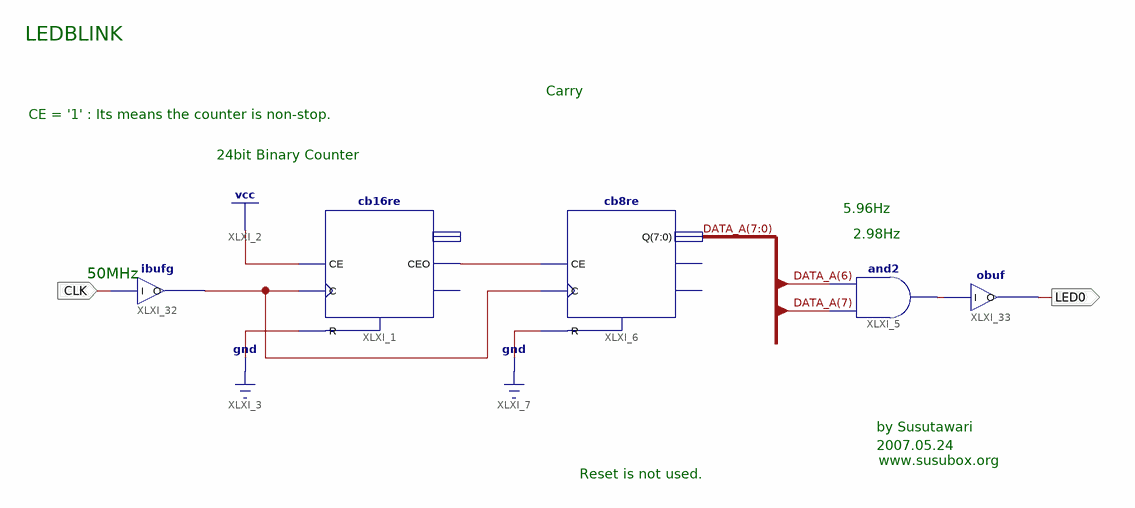
[diagram p0: schematic sheet 1]
// Xilinx ISE schematic LEDBLINK.sch (spartan6) as structural Verilog: 5 symbols, 2 ports
module LEDBLINK (
  input  CLK,
  output LED0
);

  wire XLXN_1, XLXN_62, XLXN_64;
  wire [7:0] DATA_A;

  cb16re XLXI_1 (.C(XLXN_64), .CE(1'b1), .R(1'b0), .CEO(XLXN_1));  // open: Q, TC
  ibufg XLXI_32 (.I(CLK), .O(XLXN_64));
  and XLXI_5 (XLXN_62, DATA_A[7], DATA_A[6]);
  cb8re XLXI_6 (.C(XLXN_64), .CE(XLXN_1), .R(1'b0), .Q(DATA_A));  // open: CEO, TC
  obuf XLXI_33 (.I(XLXN_62), .O(LED0));

  // Notes on the sheet:
  //   LEDBLINK
  //   Carry
  //   CE = '1' : Its means the counter is non-stop.
  //   24bit Binary Counter
  //   5.96Hz
  //   2.98Hz
  //   50MHz
  //   by Susutawari
  //   2007.05.24
  //   www.susubox.org
  //   Reset is not used.
endmodule
